# EAGLE design M961old (EAGLE 6.6.0)

## Sheet 1 of 2
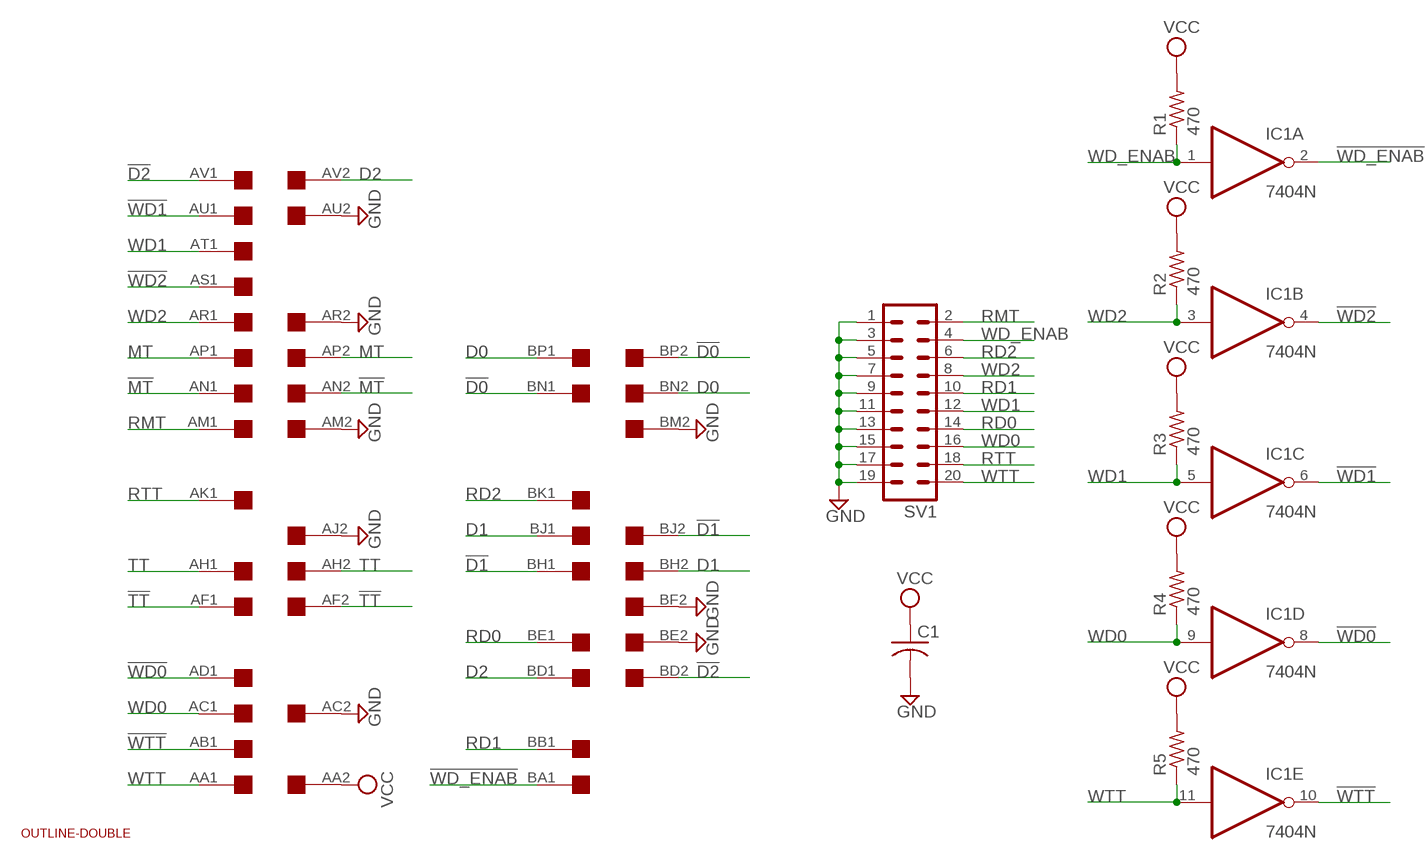
[diagram p0: schematic, sheet 1]

### Parts
C1  C-US050-025X075  [C050-025X075]
EDGE$1  DOUBLE  [EDGE-CON4]
IC1  7404N  [DIL14]
R1  470  R-US_0207/10  [0207/10]
R2  470  R-US_0207/10  [0207/10]
R3  470  R-US_0207/10  [0207/10]
R4  470  R-US_0207/10  [0207/10]
R5  470  R-US_0207/10  [0207/10]
SV1  MA10-2  [MA10-2]
U$2  OUTLINE-DOUBLE  [DOUBLE]

### Nets
!D0: EDGE$1.BN1 EDGE$1.BP2
!D1: EDGE$1.BH1 EDGE$1.BJ2
!D2: EDGE$1.AV1 EDGE$1.BD2
!MT: EDGE$1.AN1 EDGE$1.AN2
!TT: EDGE$1.AF1 EDGE$1.AF2
!WD0: EDGE$1.AD1 IC1.8(D:O)
!WD1: EDGE$1.AU1 IC1.6(C:O)
!WD2: EDGE$1.AS1 IC1.4(B:O)
!WD_ENAB: EDGE$1.BA1 IC1.2(A:O)
!WTT: EDGE$1.AB1 IC1.10(E:O)
D0: EDGE$1.BN2 EDGE$1.BP1
D1: EDGE$1.BH2 EDGE$1.BJ1
D2: EDGE$1.AV2 EDGE$1.BD1
GND: C1.2 EDGE$1.AC2 EDGE$1.AJ2 EDGE$1.AM2 EDGE$1.AR2 EDGE$1.AU2 EDGE$1.BE2 EDGE$1.BF2 EDGE$1.BM2 SV1.1 SV1.3 SV1.5 SV1.7 SV1.9 SV1.11 SV1.13 SV1.15 SV1.17 SV1.19 ; also sheet 2
MT: EDGE$1.AP1 EDGE$1.AP2
RD0: EDGE$1.BE1 SV1.14 ; also sheet 2
RD1: EDGE$1.BB1 SV1.10 ; also sheet 2
RD2: EDGE$1.BK1 SV1.6 ; also sheet 2
RMT: EDGE$1.AM1 SV1.2 ; also sheet 2
RTT: EDGE$1.AK1 SV1.18 ; also sheet 2
TT: EDGE$1.AH1 EDGE$1.AH2
VCC: C1.1 EDGE$1.AA2 R1.2 R2.2 R3.2 R4.2 R5.2
WD0: EDGE$1.AC1 IC1.9(D:I) R4.1 SV1.16 ; also sheet 2
WD1: EDGE$1.AT1 IC1.5(C:I) R3.1 SV1.12 ; also sheet 2
WD2: EDGE$1.AR1 IC1.3(B:I) R2.1 SV1.8 ; also sheet 2
WD_ENAB: IC1.1(A:I) R1.1 SV1.4 ; also sheet 2
WTT: EDGE$1.AA1 IC1.11(E:I) R5.1 SV1.20 ; also sheet 2
Unconnected: EDGE$1.AB2 EDGE$1.AD2 EDGE$1.AE1 EDGE$1.AE2 EDGE$1.AJ1 EDGE$1.AK2 EDGE$1.AL1 EDGE$1.AL2 EDGE$1.AS2 EDGE$1.AT2 EDGE$1.BA2 EDGE$1.BB2 EDGE$1.BC1 EDGE$1.BC2 EDGE$1.BF1 EDGE$1.BK2 EDGE$1.BL1 EDGE$1.BL2 EDGE$1.BM1 EDGE$1.BR1 EDGE$1.BR2 EDGE$1.BS1 EDGE$1.BS2 EDGE$1.BT1 EDGE$1.BT2 EDGE$1.BU1 EDGE$1.BU2 EDGE$1.BV1 EDGE$1.BV2 IC1.12(F:O) IC1.13(F:I)

## Sheet 2 of 2
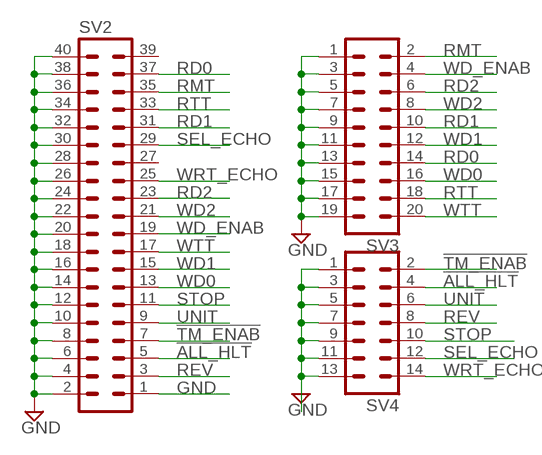
[diagram p1: schematic, sheet 2]

### Parts
SV2  MA20-2  [MA20-2]
SV3  MA10-2  [MA10-2]
SV4  MA07-2  [MA07-2]

### Nets
!ALL_HLT: SV2.5 SV4.4
!TM_ENAB: SV2.7 SV4.2
GND: SV2.1 SV2.2 SV2.4 SV2.6 SV2.8 SV2.10 SV2.12 SV2.14 SV2.16 SV2.18 SV2.20 SV2.22 SV2.24 SV2.26 SV2.28 SV2.30 SV2.32 SV2.34 SV2.36 SV2.38 SV2.40 SV3.1 SV3.3 SV3.5 SV3.7 SV3.9 SV3.11 SV3.13 SV3.15 SV3.17 SV3.19 SV4.1 SV4.3 SV4.5 SV4.7 SV4.9 SV4.11 SV4.13 ; also sheet 1
RD0: SV2.37 SV3.14 ; also sheet 1
RD1: SV2.31 SV3.10 ; also sheet 1
RD2: SV2.23 SV3.6 ; also sheet 1
REV: SV2.3 SV4.8
RMT: SV2.35 SV3.2 ; also sheet 1
RTT: SV2.33 SV3.18 ; also sheet 1
SEL_ECHO: SV2.29 SV4.12
STOP: SV2.11 SV4.10
UNIT: SV2.9 SV4.6
WD0: SV2.13 SV3.16 ; also sheet 1
WD1: SV2.15 SV3.12 ; also sheet 1
WD2: SV2.21 SV3.8 ; also sheet 1
WD_ENAB: SV2.19 SV3.4 ; also sheet 1
WRT_ECHO: SV2.25 SV4.14
WTT: SV2.17 SV3.20 ; also sheet 1
Unconnected: SV2.27 SV2.39

## Power pins joined to a net without a drawn wire
GND: IC1.7(P:GND)
VCC: IC1.14(P:VCC)

## Library data of the parts
C1 = rcl:C-US: CAPACITOR, American symbol
EDGE$1 = dec-con:DOUBLE: Double-Height DEC board
IC1 = 74xx-us:74*04: Hex INVERTER
R1-R5 = rcl:R-US_: RESISTOR, American symbol
SV1 SV3 = con-lstb:MA10-2: PIN HEADER; OC_FARNELL: unknown; OC_NEWARK: unknown
SV2 = con-lstb:MA20-2: PIN HEADER; OC_FARNELL: unknown; OC_NEWARK: unknown
SV4 = con-lstb:MA07-2: PIN HEADER; OC_FARNELL: unknown; OC_NEWARK: unknown
U$2 = dec-con:OUTLINE-*: Board outlines for DEC boards.

## Board
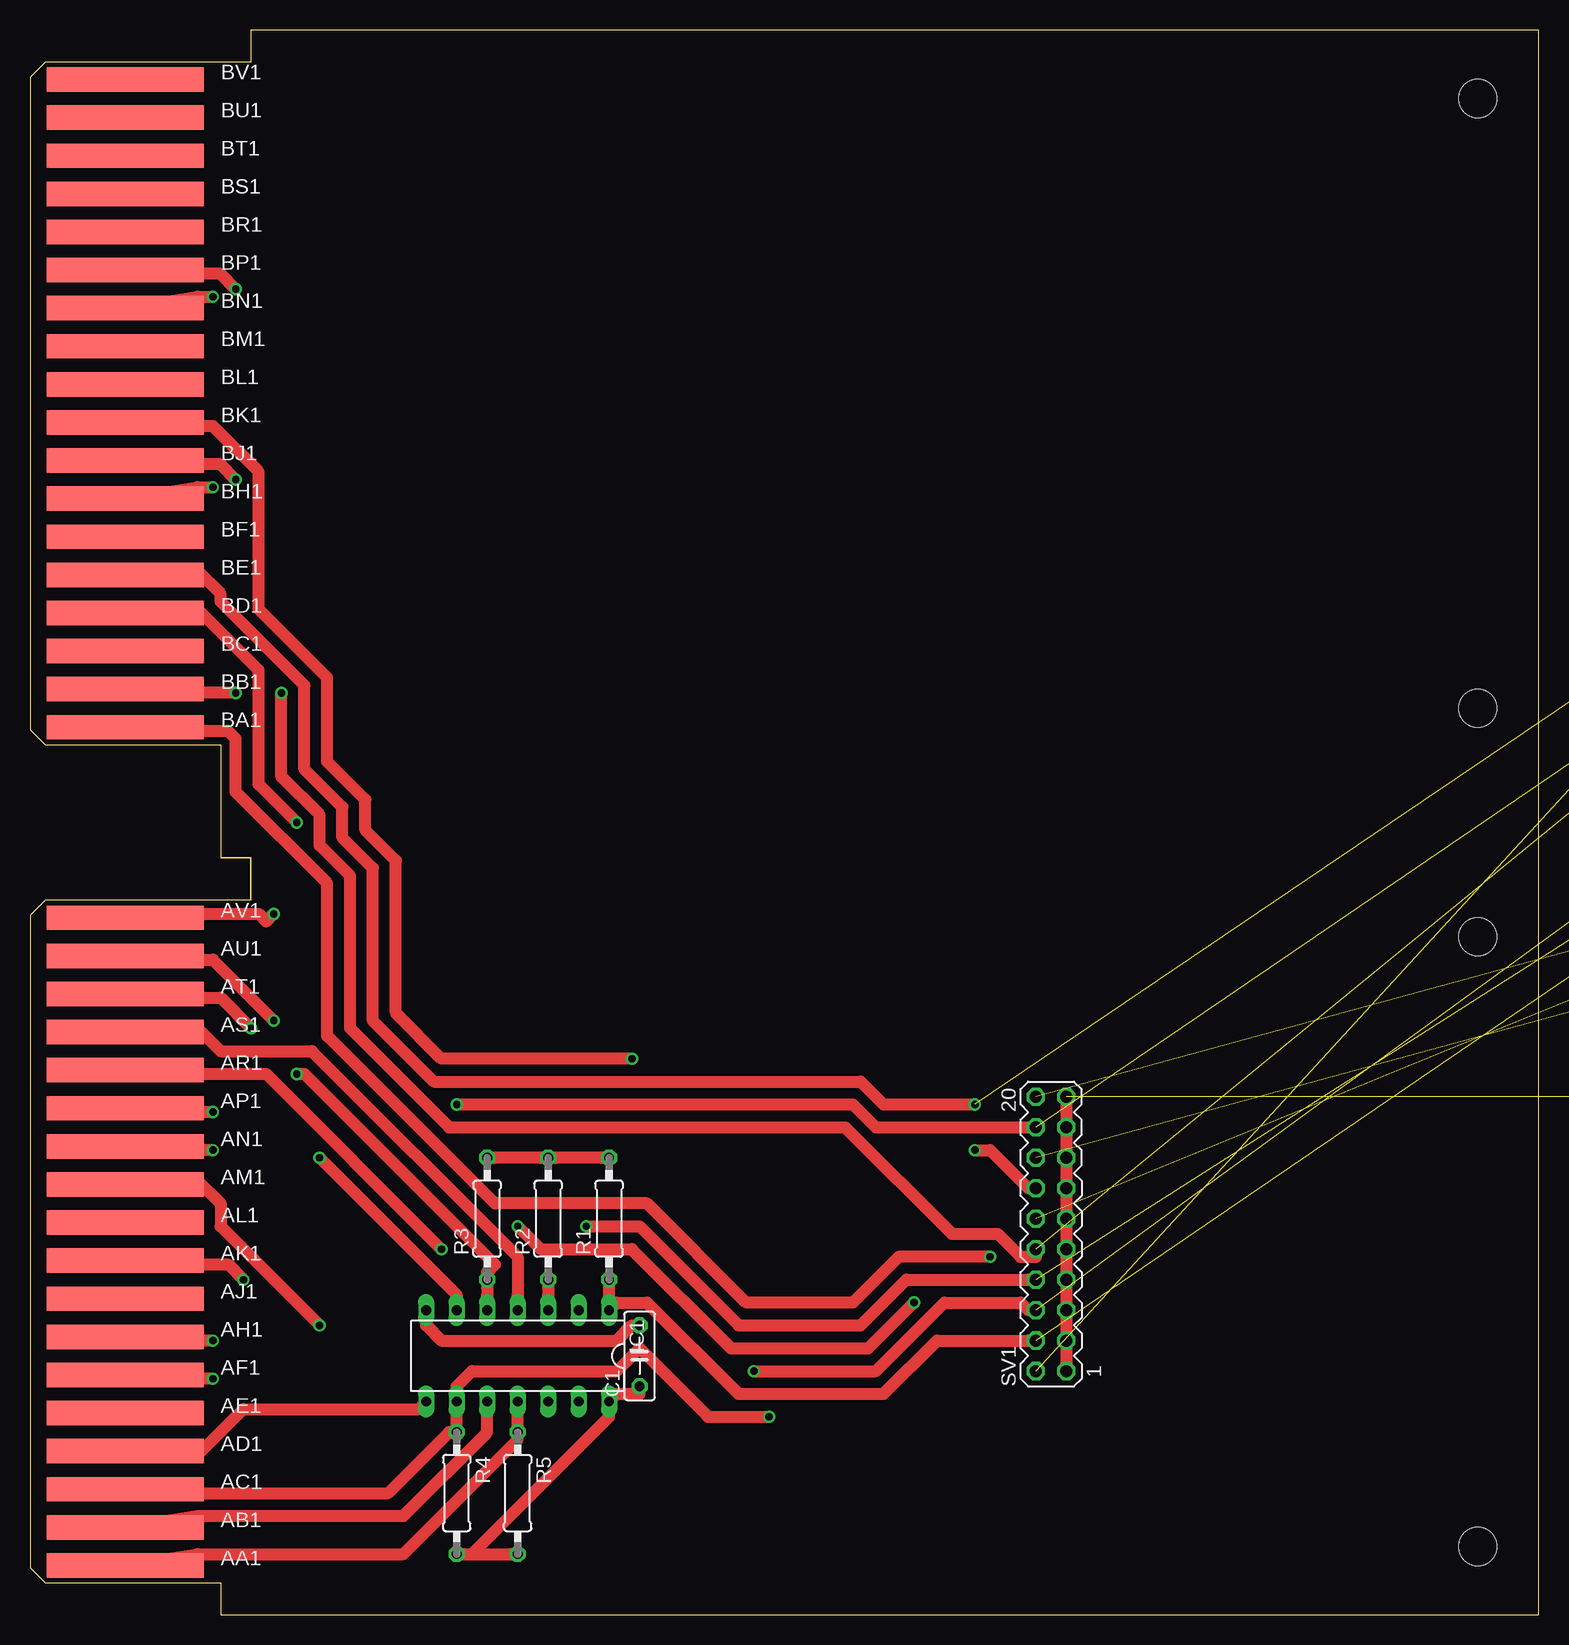
[diagram p2: board, top side]
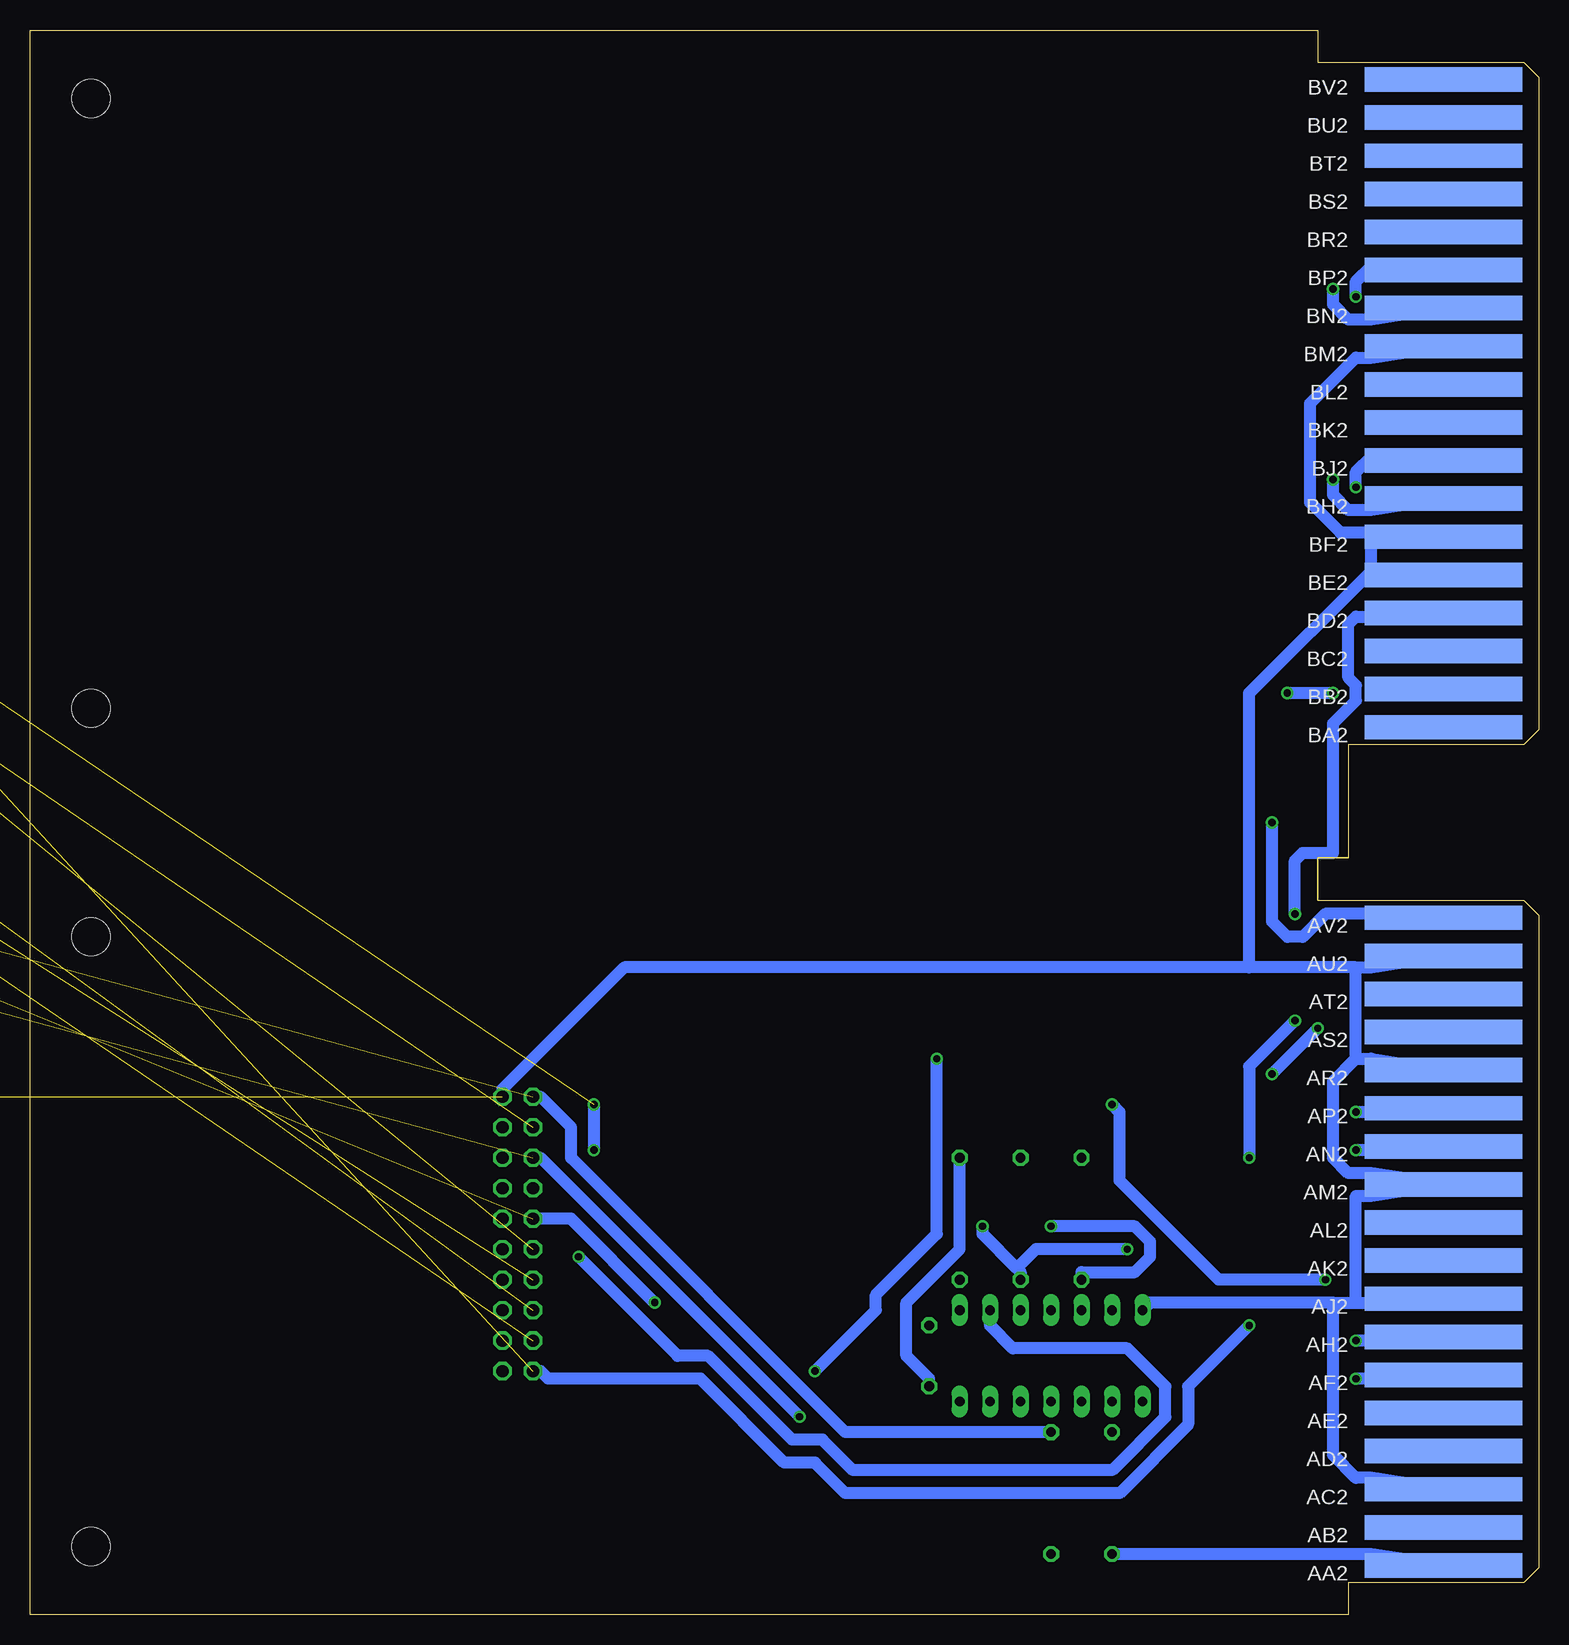
[diagram p3: board, bottom side, seen from below]

Size 125.73 x 132.08 mm. Coordinates in mm from the lower left corner, seen from the top.
Copper layers (1*16): Top 0.035mm / dielectric 1.5mm / Bottom 0.035mm
Design rules "40mils": minimum track width 40mil, minimum drill 24mil, track to track 20mil, track to pad 10mil, pad to pad 10mil, via to via 10mil, smd to smd 10mil, copper to edge 25mil, drill to drill 10mil, minimum pad ring 10mil, minimum via ring 8mil, stop-mask expansion 0mil, vias tented up to drill 0mil, thermal gap 10mil

### Footprints (pad centres in the part's own frame; a part is rotated, then mirrored left to right if it is on the bottom)
C050-025X075 = drill 0.813 octagon: 1 -2.54,0; 2 2.54,0
EDGE-CON4 = smd 13.106 x 2.032: AA1 7.938,4.128; AB1 7.938,7.303; AC1 7.938,10.477; AD1 7.938,13.652; AE1 7.938,16.828; AF1 7.938,20.003; AH1 7.938,23.177; AJ1 7.938,26.352; AK1 7.938,29.527; AL1 7.938,32.703; AM1 7.938,35.877; AN1 7.938,39.053; AP1 7.938,42.227; AR1 7.938,45.403; AS1 7.938,48.578; AT1 7.938,51.752; AU1 7.938,54.928; AV1 7.938,58.102; BA1 7.938,73.978; BB1 7.938,77.153; BC1 7.938,80.328; BD1 7.938,83.502; BE1 7.938,86.677; BF1 7.938,89.853; BH1 7.938,93.028; BJ1 7.938,96.203; BK1 7.938,99.377; BL1 7.938,102.552; BM1 7.938,105.728; BN1 7.938,108.903; BP1 7.938,112.078; BR1 7.938,115.252; BS1 7.938,118.427; BT1 7.938,121.603; BU1 7.938,124.778; BV1 7.938,127.953 | smd 13.106 x 2.032 bottom: AA2 7.938,4.128; AB2 7.938,7.303; AC2 7.938,10.477; AD2 7.938,13.652; AE2 7.938,16.828; AF2 7.938,20.003; AH2 7.938,23.177; AJ2 7.938,26.352; AK2 7.938,29.527; AL2 7.938,32.703; AM2 7.938,35.877; AN2 7.938,39.053; AP2 7.938,42.227; AR2 7.938,45.403; AS2 7.938,48.578; AT2 7.938,51.752; AU2 7.938,54.928; AV2 7.938,58.102; BA2 7.938,73.978; BB2 7.938,77.153; BC2 7.938,80.328; BD2 7.938,83.502; BE2 7.938,86.677; BF2 7.938,89.853; BH2 7.938,93.028; BJ2 7.938,96.203; BK2 7.938,99.377; BL2 7.938,102.552; BM2 7.938,105.728; BN2 7.938,108.903; BP2 7.938,112.078; BR2 7.938,115.252; BS2 7.938,118.427; BT2 7.938,121.603; BU2 7.938,124.778; BV2 7.938,127.953
DIL14 = drill 0.813 long: 1 -7.62,-3.81; 2 -5.08,-3.81; 3 -2.54,-3.81; 4 0,-3.81; 5 2.54,-3.81; 6 5.08,-3.81; 7 7.62,-3.81; 8 7.62,3.81; 9 5.08,3.81; 10 2.54,3.81; 11 0,3.81; 12 -2.54,3.81; 13 -5.08,3.81; 14 -7.62,3.81
0207/10 = drill 0.813 octagon: 1 -5.08,0; 2 5.08,0
MA10-2 = drill 1.016 octagon: 1 -11.43,-1.27; 2 -11.43,1.27; 3 -8.89,-1.27; 4 -8.89,1.27; 5 -6.35,-1.27; 6 -6.35,1.27; 7 -3.81,-1.27; 8 -3.81,1.27; 9 -1.27,-1.27; 10 -1.27,1.27; 11 1.27,-1.27; 12 1.27,1.27; 13 3.81,-1.27; 14 3.81,1.27; 15 6.35,-1.27; 16 6.35,1.27; 17 8.89,-1.27; 18 8.89,1.27; 19 11.43,-1.27; 20 11.43,1.27
MA20-2 = drill 1.016 octagon: 1 -24.13,-1.27; 2 -24.13,1.27; 3 -21.59,-1.27; 4 -21.59,1.27; 5 -19.05,-1.27; 6 -19.05,1.27; 7 -16.51,-1.27; 8 -16.51,1.27; 9 -13.97,-1.27; 10 -13.97,1.27; 11 -11.43,-1.27; 12 -11.43,1.27; 13 -8.89,-1.27; 14 -8.89,1.27; 15 -6.35,-1.27; 16 -6.35,1.27; 17 -3.81,-1.27; 18 -3.81,1.27; 19 -1.27,-1.27; 20 -1.27,1.27; 21 1.27,-1.27; 22 1.27,1.27; 23 3.81,-1.27; 24 3.81,1.27; 25 6.35,-1.27; 26 6.35,1.27; 27 8.89,-1.27; 28 8.89,1.27; 29 11.43,-1.27; 30 11.43,1.27; 31 13.97,-1.27; 32 13.97,1.27; 33 16.51,-1.27; 34 16.51,1.27; 35 19.05,-1.27; 36 19.05,1.27; 37 21.59,-1.27; 38 21.59,1.27; 39 24.13,-1.27; 40 24.13,1.27
MA07-2 = drill 1.016 octagon: 1 -7.62,-1.27; 2 -7.62,1.27; 3 -5.08,-1.27; 4 -5.08,1.27; 5 -2.54,-1.27; 6 -2.54,1.27; 7 0,-1.27; 8 0,1.27; 9 2.54,-1.27; 10 2.54,1.27; 11 5.08,-1.27; 12 5.08,1.27; 13 7.62,-1.27; 14 7.62,1.27
DOUBLE = hole 3.175: 120.65,56.515; 120.65,5.715; 120.65,75.565; 120.65,126.365

### Placement (x,y rotation side)
C1  50.8,21.59 90 top
EDGE$1  0,0 0 top
IC1  40.64,21.59 180 top
R1  48.26,33.02 90 top
R2  43.18,33.02 90 top
R3  38.1,33.02 90 top
R4  35.56,10.16 270 top
R5  40.64,10.16 270 top
SV1  85.09,31.75 90 top
SV2  138.43,62.23 90 top  (outside the outline)
SV3  158.75,74.93 90 top  (outside the outline)
SV4  158.75,45.72 90 top  (outside the outline)
U$2  0,0 0 top

### Tracks (layer width: path | path; a pad name or v marks a point on that pad's centre or on a via)
!ALL_HLT  (1 unrouted)
!D0  (via drill 0.61)
  Top 1.016: v15.24,109.86 13.97,109.86 EDGE$1.BN1
  Bottom 1.016: v15.24,109.86 15.24,111.12 13.97,112.39 EDGE$1.BP2
!D1  (via drill 0.61)
  Top 1.016: v15.24,93.98 13.97,93.98 EDGE$1.BH1
  Bottom 1.016: v15.24,93.98 15.24,95.25 13.97,96.52 EDGE$1.BJ2
!D2  (via drill 0.61)
  Top 1.016: v20.32,58.42 19.69,57.78 19.05,58.42 13.97,58.42 EDGE$1.AV1
  Bottom 1.016: v20.32,58.42 20.32,62.87 19.69,63.5 17.15,63.5 17.15,74.3 15.24,76.2 15.24,77.47 15.88,78.11 15.88,82.55 15.24,83.19 13.97,83.19 EDGE$1.BD2
!MT  (via drill 0.61)
  Top 1.016: v15.24,38.73 13.97,38.73 EDGE$1.AN2
  Bottom 1.016: v15.24,38.73 13.97,38.73 EDGE$1.AN2
!TM_ENAB  (1 unrouted)
!TT  (via drill 0.61)
  Top 1.016: v15.24,19.68 13.97,19.68 EDGE$1.AF2
  Bottom 1.016: v15.24,19.68 13.97,19.68 EDGE$1.AF2
!WD0
  Top 1.016: IC1.8 32.39,17.14 17.78,17.14 13.97,13.34 EDGE$1.AD1
!WD1  (via drill 0.61)
  Top 1.016: v24.13,38.1 35.56,26.67 IC1.6 | v20.32,49.53 15.24,54.61 13.97,54.61 EDGE$1.AU1
  Bottom 1.016: v24.13,38.1 24.13,45.72 v20.32,49.53
!WD2
  Top 1.016: IC1.4 40.64,26.67 40.64,29.84 23.5,46.99 15.88,46.99 13.97,48.9 EDGE$1.AS1
!WD_ENAB  (via drill 0.61)
  Top 1.016: v80.01,29.84 72.39,29.84 68.58,26.04 59.69,26.04 51.44,34.29 38.74,34.29 24.77,48.26 24.77,60.96 17.15,68.58 17.15,73.03 16.51,73.66 13.97,73.66 EDGE$1.BA1
  Bottom 1.016: v80.01,29.84 71.76,21.59 69.22,21.59 62.23,14.61 59.69,14.61 57.15,12.06 35.56,12.06 31.12,16.51 31.12,19.05 34.29,22.23 43.82,22.23 45.72,24.13 IC1.2
!WTT
  Top 1.016: IC1.10 38.1,16.51 38.1,15.24 31.12,8.26 13.97,8.26 EDGE$1.AB1
D0  (via drill 0.61)
  Top 1.016: v17.15,110.49 15.88,111.76 13.97,111.76 EDGE$1.BP1
  Bottom 1.016: v17.15,110.49 17.15,109.22 15.88,107.95 13.97,107.95 EDGE$1.BN2
D1  (via drill 0.61)
  Top 1.016: v17.15,94.61 15.88,95.89 13.97,95.89 EDGE$1.BJ1
  Bottom 1.016: v17.15,94.61 17.15,93.34 15.88,92.08 13.97,92.08 EDGE$1.BH2
D2  (via drill 0.61)
  Top 1.016: v22.23,66.04 19.05,69.22 19.05,78.74 13.97,83.82 EDGE$1.BD1
  Bottom 1.016: v22.23,66.04 22.23,57.78 20.96,56.52 19.69,56.52 17.78,58.42 13.97,58.42 EDGE$1.AV2
GND  (38 unrouted)
  Top 1.016: C1.2 50.17,24.13 48.9,22.86 34.29,22.86 33.02,24.13 IC1.7 | SV1.1 SV1.3 SV1.5 SV1.7 SV1.9 SV1.11 SV1.13 SV1.15 SV1.17 SV1.19
  Bottom 1.016: 15.24,26.04 13.97,26.04 EDGE$1.AJ2 | 17.15,26.04 15.24,26.04 | 17.15,26.04 32.39,26.04 IC1.7 | 17.15,26.04 17.15,13.34 15.24,11.43 13.97,11.43 EDGE$1.AC2 | 15.24,26.04 15.24,34.92 13.97,34.92 EDGE$1.AM2 13.97,36.83 15.88,36.83 17.15,38.1 17.15,44.45 15.24,46.35 | 13.97,87 13.97,86.36 EDGE$1.BE2 13.97,87 | 13.97,87 13.97,90.17 | EDGE$1.BM2 13.97,104.78 15.24,104.78 19.05,100.97 19.05,92.71 16.51,90.17 13.97,90.17 | 15.24,53.98 13.97,53.98 EDGE$1.AU2 | 15.24,53.98 24.13,53.98 | 24.13,53.98 76.2,53.98 86.36,43.81 SV1.19 | 15.24,46.35 13.97,46.35 EDGE$1.AR2 | 15.24,46.35 15.24,53.98 | 13.97,90.17 EDGE$1.BF2 | 13.97,87 24.13,76.83 24.13,53.98
MT  (via drill 0.61)
  Top 1.016: v15.24,41.91 13.97,41.91 EDGE$1.AP2
  Bottom 1.016: v15.24,41.91 13.97,41.91 EDGE$1.AP2
RD0  (via drill 0.61)  (2 unrouted)
  Top 1.016: v78.74,38.73 80.01,38.73 83.19,35.56 SV1.14 | v78.74,42.55 71.12,42.55 69.22,44.45 33.66,44.45 28.58,49.53 28.58,62.23 26.04,64.77 26.04,67.31 22.86,70.48 22.86,77.47 15.88,84.45 15.88,85.09 13.97,87 EDGE$1.BE1
  Bottom 1.016: v78.74,42.55 v78.74,38.73
RD1  (via drill 0.61)  (2 unrouted)
  Top 1.016: v17.15,76.83 13.97,76.83 EDGE$1.BB1 | v20.96,76.83 20.96,69.85 24.13,66.67 24.13,64.14 26.67,61.59 26.67,48.9 34.93,40.64 67.95,40.64 76.84,31.75 80.65,31.75 82.55,29.84 83.82,29.84 SV1.10
  Bottom 1.016: v20.96,76.83 v17.15,76.83
RD2  (via drill 0.61)  (2 unrouted)
  Top 1.016: v60.33,20.32 70.49,20.32 76.2,26.04 82.55,26.04 83.19,25.4 SV1.6 | v50.17,46.35 34.29,46.35 30.48,50.16 30.48,62.87 27.94,65.41 27.94,67.94 24.77,71.12 24.77,78.11 19.05,83.82 19.05,95.25 15.24,99.06 13.97,99.06 EDGE$1.BK1
  Bottom 1.016: v60.33,20.32 55.25,25.4 55.25,26.67 50.17,31.75 v50.17,46.35
REV  (1 unrouted)
RMT  (via drill 0.61)  (2 unrouted)
  Top 1.016: v24.13,24.13 15.88,32.38 15.88,34.29 13.97,36.2 EDGE$1.AM1
  Bottom 1.016: v24.13,24.13 29.21,19.05 29.21,15.88 34.93,10.16 57.79,10.16 60.33,12.7 62.87,12.7 69.85,19.68 82.55,19.68 83.19,20.32 SV1.2
RTT  (via drill 0.61)  (2 unrouted)
  Top 1.016: v17.78,27.94 16.51,29.21 13.97,29.21 EDGE$1.AK1 | v35.56,42.55 68.58,42.55 70.49,40.64 83.19,40.64 SV1.18
  Bottom 1.016: v17.78,27.94 26.67,27.94 34.93,36.2 34.93,41.91 v35.56,42.55
SEL_ECHO  (1 unrouted)
STOP  (1 unrouted)
TT  (via drill 0.61)
  Top 1.016: v15.24,22.86 13.97,22.86 EDGE$1.AH2
  Bottom 1.016: v15.24,22.86 13.97,22.86 EDGE$1.AH2
UNIT  (1 unrouted)
VCC
  Top 1.016: R3.2 38.74,38.1 42.55,38.1 R2.2 43.82,38.1 47.63,38.1 R1.2 | C1.1 50.8,18.41 48.9,18.41 IC1.14 48.26,16.51 36.83,5.08 | 36.83,5.08 40.01,5.08 R5.2 | 36.83,5.08 36.2,5.08 R4.2
  Bottom 1.016: R1.2 48.26,37.47 48.26,30.48 52.71,26.04 52.71,21.59 50.8,19.68 C1.1 | EDGE$1.AA2 13.97,5.08 34.93,5.08 R4.2
WD0  (via drill 0.61)  (2 unrouted)
  Top 1.016: v61.6,16.51 56.52,16.51 50.8,22.23 48.9,20.32 36.83,20.32 35.56,19.05 IC1.9 35.56,16.51 35.56,15.88 R4.1 34.93,15.24 29.85,10.16 13.97,10.16 EDGE$1.AC1
  Bottom 1.016: v61.6,16.51 83.19,38.1 SV1.16
WD1  (via drill 0.61)  (2 unrouted)
  Top 1.016: v18.42,48.9 15.88,51.44 13.97,51.44 EDGE$1.AT1 | v22.23,45.09 22.86,45.09 38.74,29.21 38.1,28.57 R3.1 38.1,27.3 38.1,26.67 IC1.5 | v73.66,26.04 69.85,22.23 58.42,22.23 50.17,30.48 42.55,30.48 v40.64,32.38
  Bottom 1.016: v18.42,48.9 v22.23,45.09 | v73.66,26.04 80.65,33.02 83.19,33.02 SV1.12 | v40.64,32.38 33.66,32.38 32.39,31.11 32.39,29.84 33.66,28.57 38.1,28.57 R3.1
WD2  (via drill 0.61)  (2 unrouted)
  Top 1.016: IC1.3 43.18,26.67 43.18,27.3 R2.1 | v46.36,32.38 50.8,32.38 59.06,24.13 69.22,24.13 73.03,27.94 83.19,27.94 SV1.8 | v34.29,30.48 19.69,45.09 13.97,45.09 EDGE$1.AR1
  Bottom 1.016: v46.36,32.38 46.36,31.75 43.5,28.89 | 43.5,28.89 43.18,28.57 R2.1 | v34.29,30.48 41.91,30.48 43.18,29.21 43.5,28.89
WD_ENAB  (2 unrouted)
  Top 1.016: R1.1 48.26,27.3 48.26,26.67 IC1.1 48.9,26.04 51.44,26.04 59.06,18.41 71.12,18.41 75.57,22.86 83.19,22.86 SV1.4
WRT_ECHO  (1 unrouted)
WTT  (2 unrouted)
  Top 1.016: IC1.11 40.64,16.51 40.64,15.88 R5.1 40.64,14.61 31.12,5.08 13.97,5.08 EDGE$1.AA1
  Bottom 1.016: SV1.20 83.19,43.18 80.65,40.64 80.65,38.1 57.79,15.24 41.28,15.24 R5.1